# EAGLE schematic PracticumSchematic (EAGLE 8.4.0)
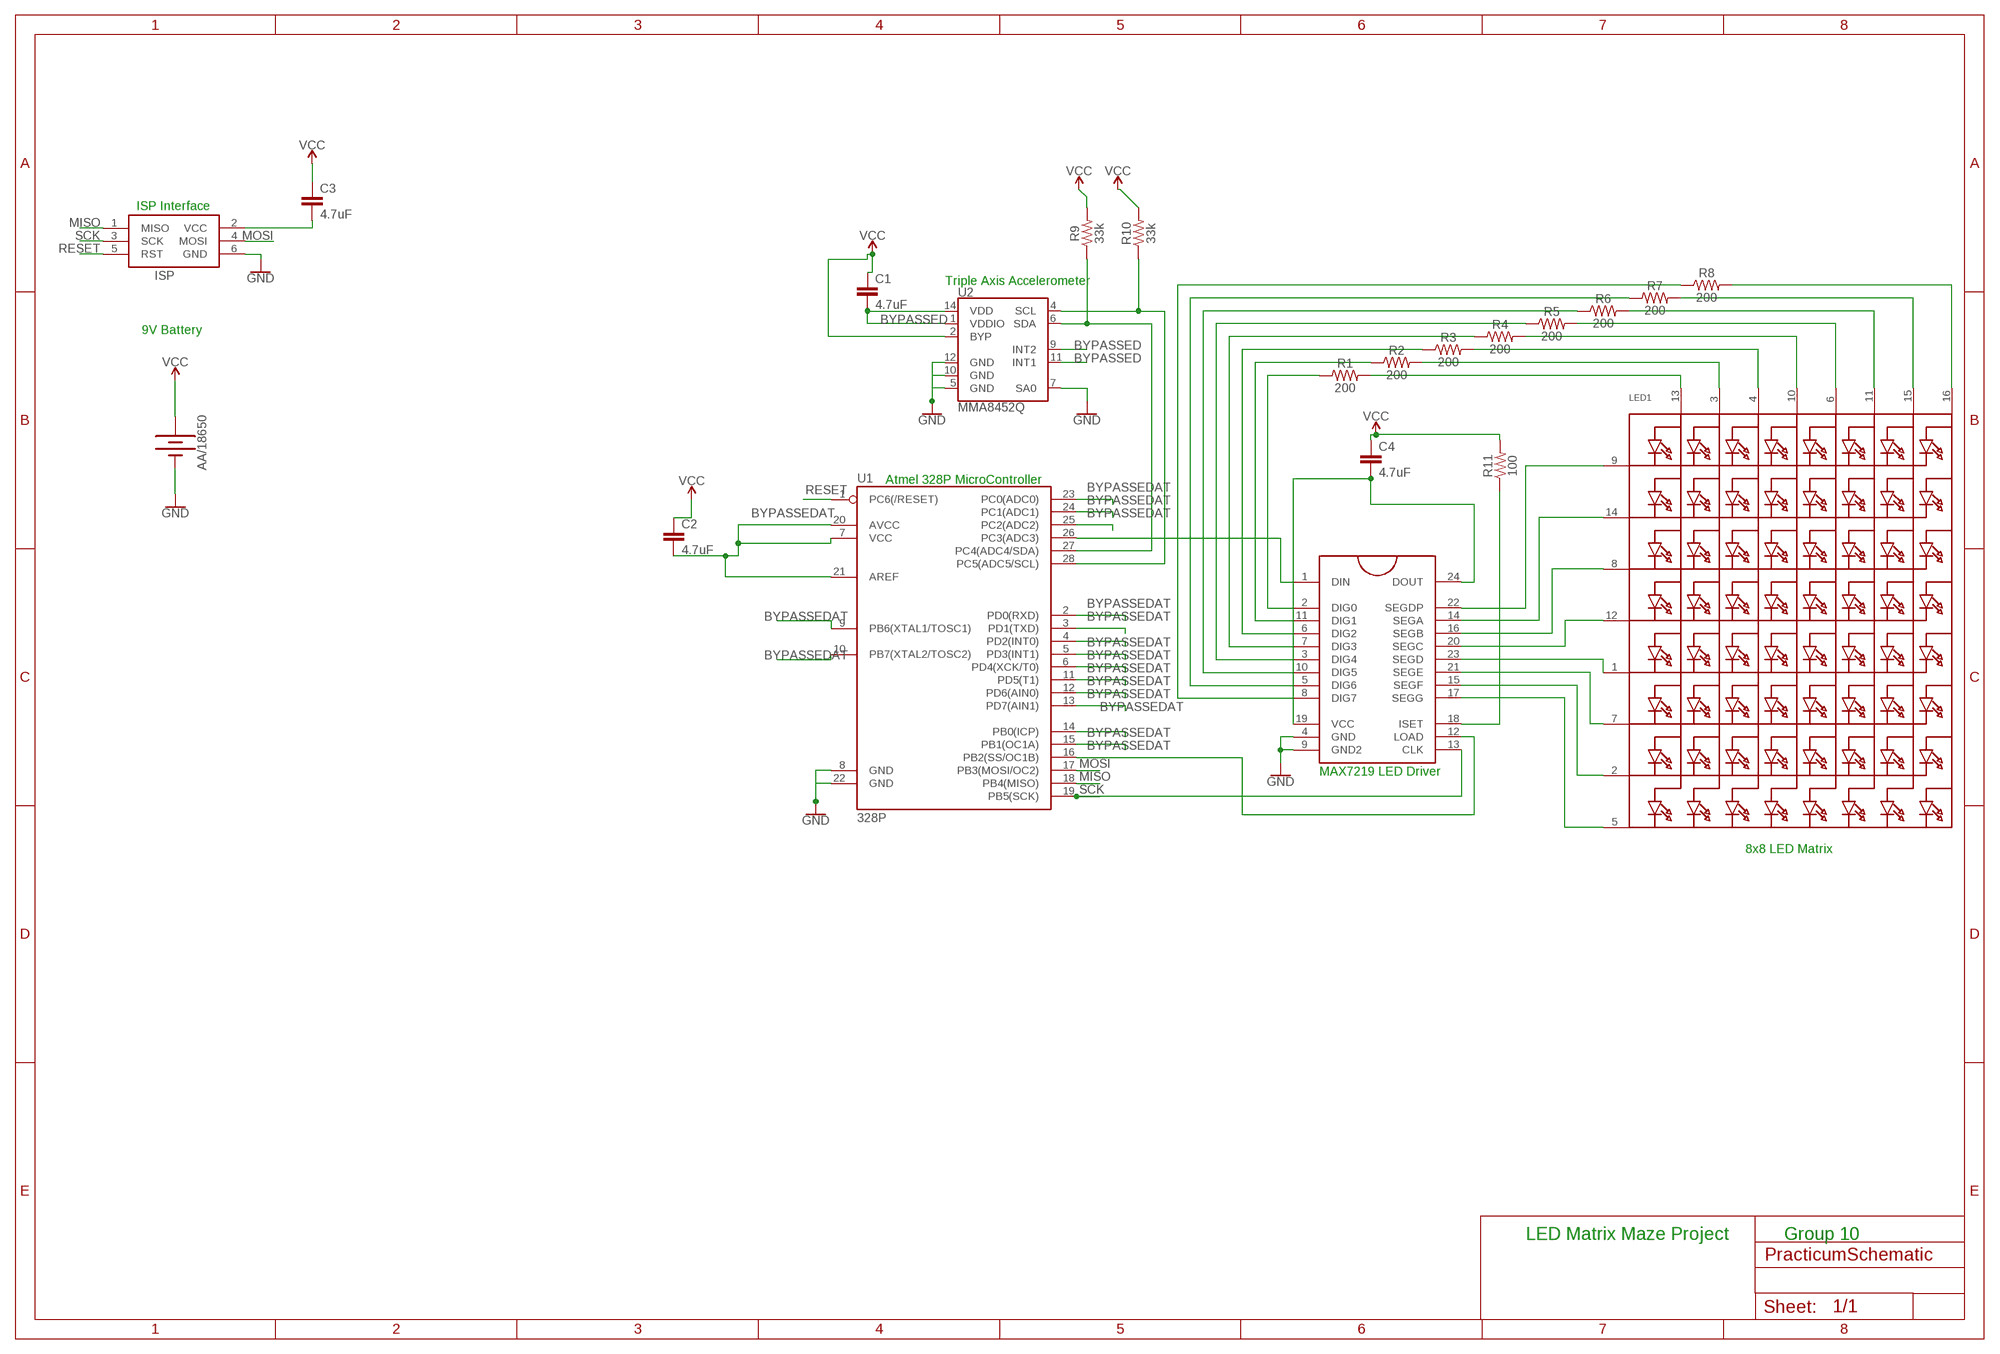
[diagram p0: schematic, sheet 1]

## Parts
AA/18650  BATTERY-9V  [BATTCON_9V]
C1  4.7uF  4.7UF0603  [0603]
C2  4.7uF  4.7UF0603  [0603]
C3  4.7uF  4.7UF0603  [0603]
C4  4.7uF  4.7UF0603  [0603]
ISP  AVRISP-6  [AVRISP]
LED1  SEGMENT_8X8_ROWCATHODEM12A881UR  [SEGMENT_BL-M12A881UR]
R1  200  200OHM-0603-1/10W-1%  [0603]
R2  200  200OHM-0603-1/10W-1%  [0603]
R3  200  200OHM-0603-1/10W-1%  [0603]
R4  200  200OHM-0603-1/10W-1%  [0603]
R5  200  200OHM-0603-1/10W-1%  [0603]
R6  200  200OHM-0603-1/10W-1%  [0603]
R7  200  200OHM-0603-1/10W-1%  [0603]
R8  200  200OHM-0603-1/10W-1%  [0603]
R9  33k  33KOHM-0603-1/10W-1%  [0603]
R10  33k  33KOHM-0603-1/10W-1%  [0603]
R11  100  100OHM-0603-1/4W-5%  [0603]
U1  328P  ATMEGA328P_PDIP  [DIP28]
U2  MMA8452Q  [QFN-16]
U$1  MAX7219DIP  [DIL24]

## Nets
BYPASSED: C1.2 U2.1(VDDIO) U2.9(INT2) U2.11(INT1) U2.14(VDD)
BYPASSEDAT: C2.2 U1.2(PD0(RXD)) U1.3(PD1(TXD)) U1.4(PD2(INT0)) U1.5(PD3(INT1)) U1.6(PD4(XCK/T0)) U1.7(VCC) U1.9(PB6(XTAL1/TOSC1)) U1.10(PB7(XTAL2/TOSC2)) U1.11(PD5(T1)) U1.12(PD6(AIN0)) U1.13(PD7(AIN1)) U1.14(PB0(ICP)) U1.15(PB1(OC1A)) U1.20(AVCC) U1.21(AREF) U1.23(PC0(ADC0)) U1.24(PC1(ADC1)) U1.25(PC2(ADC2))
GND: AA/18650.- ISP.6(GND) U1.8(GND) U1.22(GND) U2.5(GND) U2.7(SA0) U2.10(GND) U2.12(GND) U$1.4(GND) U$1.9(GND2)
MISO: ISP.1(MISO) U1.18(PB4(MISO))
MOSI: ISP.4(MOSI) U1.17(PB3(MOSI/OC2))
N$1: LED1.9(K1) U$1.22(SEGDP)
N$2: LED1.14(K2) U$1.14(SEGA)
N$3: LED1.8(K3) U$1.16(SEGB)
N$4: LED1.12(K4) U$1.20(SEGC)
N$5: LED1.1(K5) U$1.23(SEGD)
N$6: LED1.7(K6) U$1.21(SEGE)
N$7: LED1.2(K7) U$1.15(SEGF)
N$8: LED1.5(K8) U$1.17(SEGG)
N$9: LED1.13(A1) R1.2
N$10: R2.1 U$1.11(DIG1)
N$11: R3.1 U$1.6(DIG2)
N$12: R4.1 U$1.7(DIG3)
N$13: R5.1 U$1.3(DIG4)
N$14: R6.1 U$1.10(DIG5)
N$15: R7.1 U$1.5(DIG6)
N$16: R8.1 U$1.8(DIG7)
N$17: U1.26(PC3(ADC3)) U$1.1(DIN)
N$18: R10.1 U1.28(PC5(ADC5/SCL)) U2.4(SCL)
N$19: R9.1 U1.27(PC4(ADC4/SDA)) U2.6(SDA)
N$20: U1.16(PB2(SS/OC1B)) U$1.12(LOAD)
N$21: R1.1 U$1.2(DIG0)
N$22: LED1.3(A2) R2.2
N$23: LED1.4(A3) R3.2
N$24: LED1.10(A4) R4.2
N$25: LED1.6(A5) R5.2
N$26: LED1.11(A6) R6.2
N$27: LED1.15(A7) R7.2
N$28: LED1.16(A8) R8.2
N$29: C3.2 ISP.2(VCC)
N$30: C4.2 U$1.19(VCC) U$1.24(DOUT)
N$32: R11.1 U$1.18(ISET)
RESET: ISP.5(RST) U1.1(PC6(/RESET))
SCK: ISP.3(SCK) U1.19(PB5(SCK)) U$1.13(CLK)
VCC: AA/18650.+ C1.1 C2.1 C3.1 C4.1 R9.2 R10.2 R11.2 U2.2(BYP)

## Notes on the sheet
- ISP Interface
- Triple Axis Accelerometer
- 9V Battery
- Atmel 328P MicroController
- MAX7219 LED Driver
- 8x8 LED Matrix
- LED Matrix Maze Project | Group 10

## Library data of the parts
AA/18650 = SparkFun-Batteries:BATTERY: Battery - Single Cell A variety of battery chemistries, sizes, and footprints. Device List: 20MM_PTH - Coin Cell Battery Holder - 20mm (PTH) <https://www.sparkfun.com/products/783> 6.8MM_PTH - Coin Cell Battery Holder - 6.8MM(SMD) <https://www.digikey.com/product-detail/en/seiko-instruments/MS621FE-FL11E/728-1057-ND/1889208?WT.srch=1&gclid=CNOQ5a6LzdQCFZS2wAodXCkE0g> 12MM_SMD - Coin Cell Battery Holder - 12mm (SMD) <https://www.sparkfun.com/products/10592> 12MM_PTH - Coin Cell Battery Holder - 12mm (PTH) <https://www.sparkfun.com/products/7948> 20MM_SMD - 20mm Coin Cell Battery Holder (SMD) (2 legs) Used on the Big Time Watch Kit <https://www.sparkfun.com/products/11734> 20MM_SMD_4LEGS - Coin Cell Battery Holder - 20mm (SMD) <https://www.sparkfun.com/products/11892> 20MM_SMD_4LEGS_OVERPASTE - Coin Cell Battery Holder - 20mm (SMD) <https://www.sparkfun.com/products/11892> (Over-paste on the legs) 24.5MM_PTH - Coin Cell Battery Holder - 24.5mm (PTH) <https://www.sparkfun.com/products/8863> 9V - 9V Battery Holder - PC Mount Used on the SparkFun SparkPunk Sound Kit <https://www.sparkfun.com/products/11177> and SparkFun SparkPunk Sequencer Kit <https://www.sparkfun.com/products/12707> 18650 - Battery Holder - 18650 (PTH) <https://www.sparkfun.com/products/13113> AA - Battery Holder - 1xAA (PTH) <https://www.sparkfun.com/products/7949> AAA - Battery Holder - 1xAAA (PTH) <https://www.sparkfun.com/products/12718> AA_KIT - Battery Holder - 1xAA (PTH) <https://www.sparkfun.com/products/7949> Special kit package - pads only have exposed copper on one side of the board. AAA_KIT - Battery Holder - 1xAAA (PTH) <https://www.sparkfun.com/products/12718> Special kit package - pads only have exposed copper on one side of the board.; PROD_ID: BATT-10855
C1-C4 = SparkFun-Capacitors:4.7UF: 4.7ÂµF ceramic capacitors A capacitor is a passive two-terminal electrical component used to store electrical energy temporarily in an electric field.; PROD_ID: CAP-08280
ISP = adafruit:AVRISP: AVR ISP HEADER Standard 6 pin header for AVR programming
LED1 = adafruit:SEGMENT_8X8_ROWCATHODE: 8x8 LED Segment Displays: Row = Cathode 0.7" Red 8X8 Matrix, 1.9mm Round LEDs - BL-M07C881UR 1.2" Red 8x8 Matrix, 3.0mm Round LEDs - BL-M12A881UR 1.2" Red 8x8 Matrix, 3.0mm Square LEDs - BL-M12A883
R1-R8 = SparkFun-Resistors:200OHM: 200O resistor A resistor is a passive two-terminal electrical component that implements electrical resistance as a circuit element. Resistors act to reduce current flow, and, at the same time, act to lower voltage levels within circuits. - Wikipedia; PROD_ID: RES-08220
R9 R10 = SparkFun-Resistors:33KOHM: 33kÎ© resistor A resistor is a passive two-terminal electrical component that implements electrical resistance as a circuit element. Resistors act to reduce current flow, and, at the same time, act to lower voltage levels within circuits. - Wikipedia; PROD_ID: RES-08416
R11 = SparkFun-Resistors:100OHM: 100Î© resistor A resistor is a passive two-terminal electrical component that implements electrical resistance as a circuit element. Resistors act to reduce current flow, and, at the same time, act to lower voltage levels within circuits. - Wikipedia; PROD_ID: RES-12438
U1 = SparkFun-IC-Microcontroller:ATMEGA328P_PDIP: Atmel 328P Through hole ATMEGA328P uC used in the Arduino 32kb flash, 1k EEPROM, 2k SRAM Datasheet <http://www.sparkfun.com/datasheets/Components/SMD/ATMega328.pdf> SparkFun Products Storefront component: AVR 28 Pin 20MHz 32K 6A/D - ATMega328P <https://www.sparkfun.com/products/9061> (COM-09061) SparkFun Simon Says - Through-Hole Soldering Kit <https://www.sparkfun.com/products/10547> (KIT-10547) SparkFun Learn to Solder - Simon Says <https://www.sparkfun.com/products/13708> (KIT-13708) SparkFun BigTime Watch Kit <https://www.sparkfun.com/products/11734> (KIT-11734) SparkFun ClockIt <https://www.sparkfun.com/products/10930> (KIT-10930) SparkFun Serial Enabled LCD Kit <https://www.sparkfun.com/products/10097> (LCD-10097) SparkFun Simon Tilts - Through Hole Soldering Kit <https://www.sparkfun.com/products/12634> (KIT-12634) SparkFun Frequency Counter Kit <https://www.sparkfun.com/products/10140> (KIT-10140) FabFM Radio Kit <https://www.sparkfun.com/products/11043> (KIT-11043) SparkFun Binary Blaster Kit <https://www.sparkfun.com/products/12037> (KIT-12037) SparkFun Metro-Gnome <https://www.sparkfun.com/products/9236> (KIT-09236) ATmega328 with Arduino Optiboot (Uno) <https://www.sparkfun.com/products/10524> (DEV-10524); PROD_ID: IC-09136
U2 = SparkFun-Sensors:MMA8452Q: NXP MMA8452Q 3-Axis Digital Accelerometer The MMA8452Q is a smart low-power, three-axis, capacitive MEMS accelerometer with 12 bits of resolution. This accelerometer is packed with embedded functions with flexible user programmable options, configurable to two interrupt pins. Supply Voltage: 1.6-3.6V Range: +/- 2g, 4g, 8g Interface: I2C, 12-bit and 8-bit ODR: 1.56 Hz - 800 Hz Package: QFN-16 Datasheet <http://cache.freescale.com/files/sensors/doc/data_sheet/MMA8452Q.pdf> SparkFun Products SparkFun Triple Axis Accelerometer Breakout - MMA8452Q <https://www.sparkfun.com/products/12756> (SEN-12756) SparkFun RedBot Sensor - Accelerometer <https://www.sparkfun.com/products/12589> (SEN-12589); PROD_ID: IC-10769
U$1 = SparkFun-Retired:MAX7219: 8-digit, 8-segment LED display driver, serial input